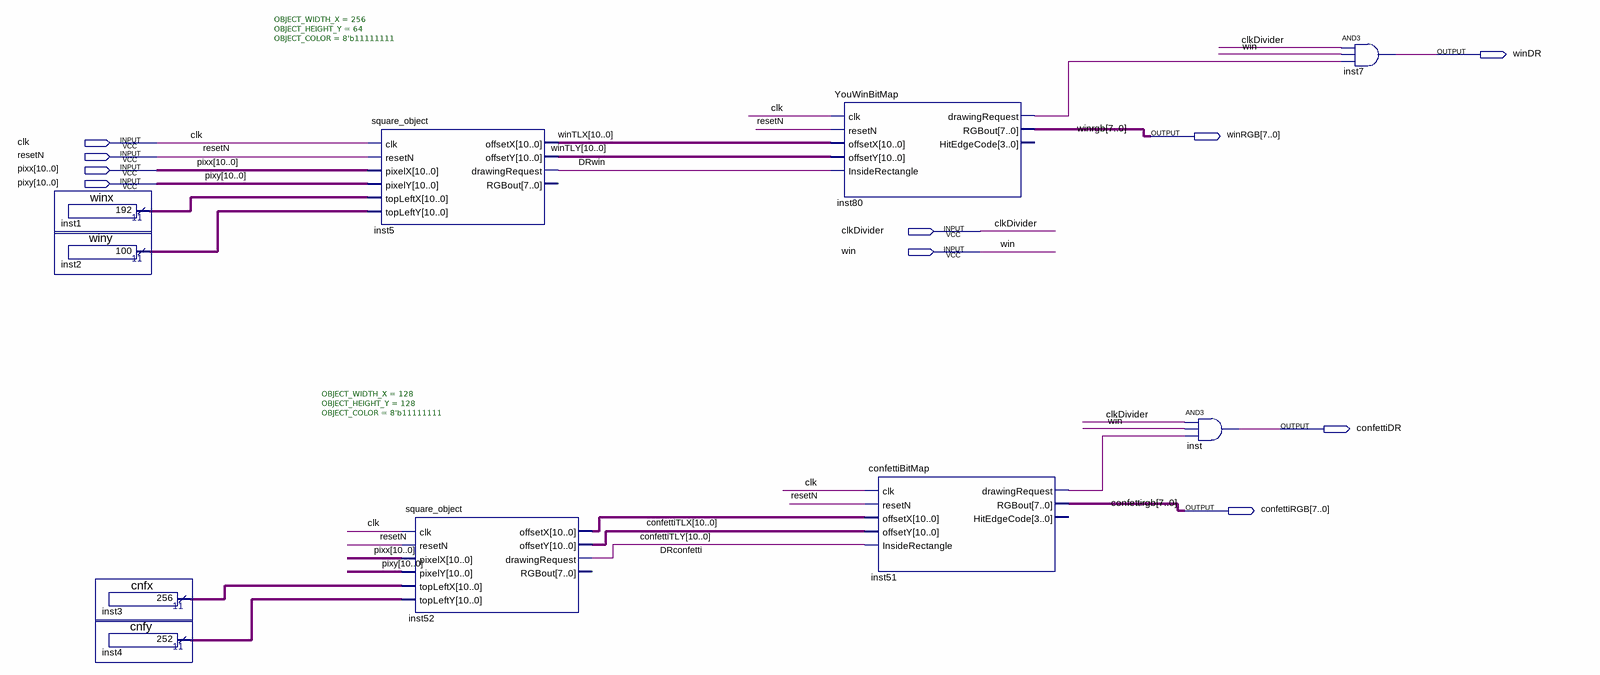
[diagram p0: schematic sheet]
// Quartus schematic winDisplay.bdf as structural Verilog: 10 symbols, 10 pins
module winDisplay (
  input  clk,
  input  resetN,
  input  [10:0] pixx,
  input  [10:0] pixy,
  input  clkDivider,
  input  win,
  output winDR,
  output [7:0] winRGB,
  output confettiDR,
  output [7:0] confettiRGB
);

  wire DRconfetti, DRwin, inst51_drawingrequest, inst80_drawingrequest;
  wire [10:0] confettiTLX, confettiTLY, inst1_result, inst2_result, inst3_result, inst4_result, winTLX,
       winTLY;

  winx inst1 (.result(inst1_result));
  winy inst2 (.result(inst2_result));
  cnfx inst3 (.result(inst3_result));
  cnfy inst4 (.result(inst4_result));
  square_object #(.OBJECT_WIDTH_X(256), .OBJECT_HEIGHT_Y(64), .OBJECT_COLOR(8'b11111111)) inst5 (
    .clk(clk), .resetN(resetN), .pixelX(pixx), .pixelY(pixy), .topLeftX(inst1_result),
    .topLeftY(inst2_result), .offsetX(winTLX), .offsetY(winTLY), .drawingRequest(DRwin));  // open: RGBout
  square_object #(.OBJECT_WIDTH_X(128), .OBJECT_HEIGHT_Y(128), .OBJECT_COLOR(8'b11111111)) inst52 (
    .clk(clk), .resetN(resetN), .pixelX(pixx), .pixelY(pixy), .topLeftX(inst3_result),
    .topLeftY(inst4_result), .offsetX(confettiTLX), .offsetY(confettiTLY), .drawingRequest(DRconfetti));  // open: RGBout
  YouWinBitMap inst80 (
    .clk(clk), .resetN(resetN), .offsetX(winTLX), .offsetY(winTLY), .InsideRectangle(DRwin),
    .drawingRequest(inst80_drawingrequest), .RGBout(winRGB));  // open: HitEdgeCode
  confettiBitMap inst51 (
    .clk(clk), .resetN(resetN), .offsetX(confettiTLX), .offsetY(confettiTLY), .InsideRectangle(DRconfetti),
    .drawingRequest(inst51_drawingrequest), .RGBout(confettiRGB));  // open: HitEdgeCode
  and inst (confettiDR, clkDivider, win, inst51_drawingrequest);
  and inst7 (winDR, clkDivider, win, inst80_drawingrequest);
endmodule
